# EAGLE design PRE_1_0 (EAGLE 8.3.2)
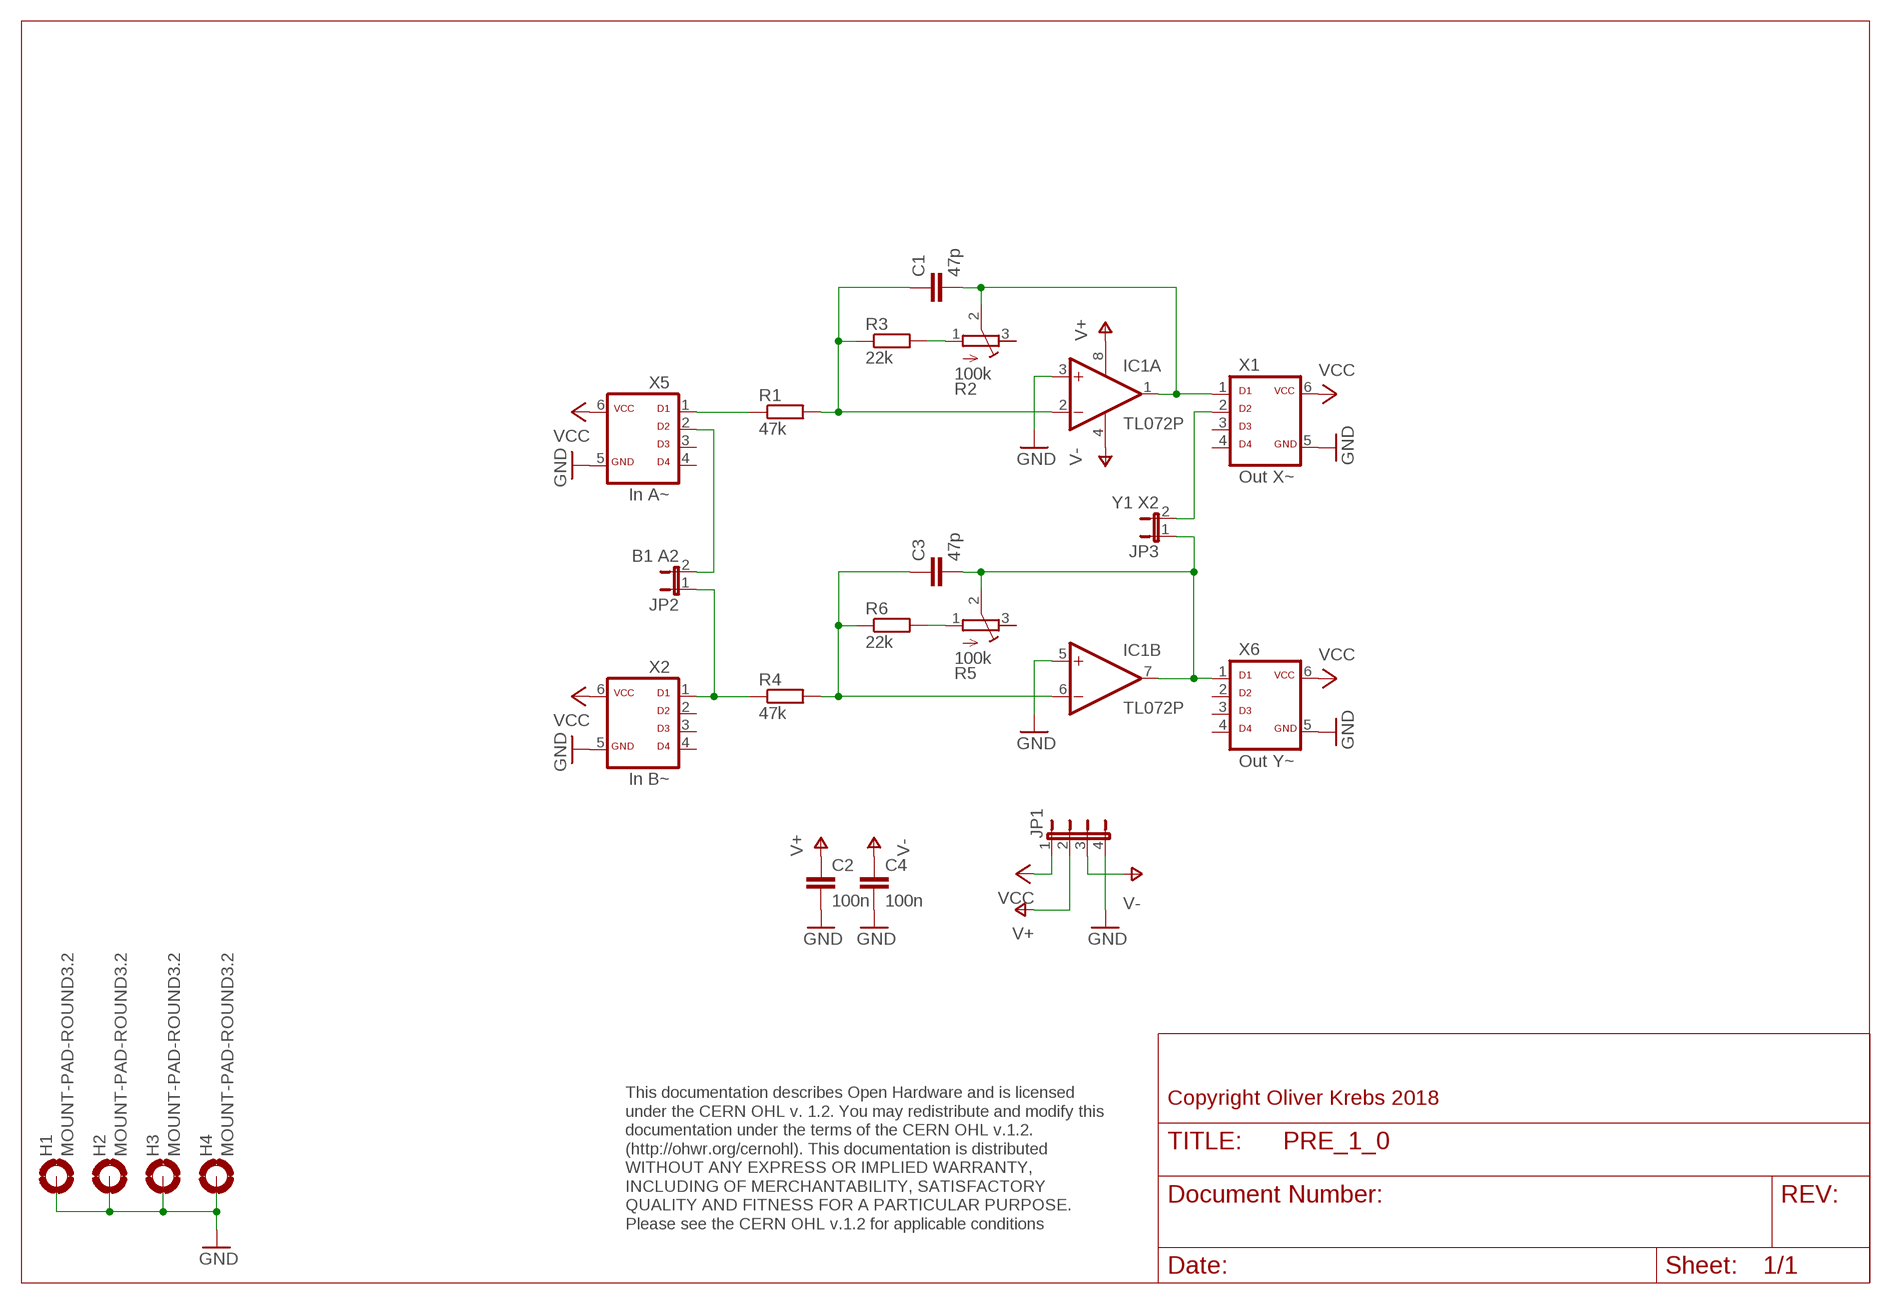
[diagram p0: schematic, sheet 1]

## Parts
C1  47p  C-EU050-025X075  [C050-025X075]
C2  100n  C-EU050-025X075  [C050-025X075]
C3  47p  C-EU050-025X075  [C050-025X075]
C4  100n  C-EU050-025X075  [C050-025X075]
H1  MOUNT-PAD-ROUND3.2  [3,2-PAD]
H2  MOUNT-PAD-ROUND3.2  [3,2-PAD]
H3  MOUNT-PAD-ROUND3.2  [3,2-PAD]
H4  MOUNT-PAD-ROUND3.2  [3,2-PAD]
IC1  TL072P  [DIL08]
JP1  JP4E  [JP4]
JP2  B1 A2  JP1E  [JP1]
JP3  Y1 X2  JP1E  [JP1]
R1  47k  R-EU_0207/10  [0207/10]
R2  100k  R-TRIMMACP  [ACP-6L]
R3  22k  R-EU_0207/10  [0207/10]
R4  47k  R-EU_0207/10  [0207/10]
R5  100k  R-TRIMMACP  [ACP-6L]
R6  22k  R-EU_0207/10  [0207/10]
X1  Out X~  ML6D  [ML-6]
X2  In B~  ML6D  [ML-6]
X5  In A~  ML6D  [ML-6]
X6  Out Y~  ML6D  [ML-6]

## Nets
GND: C2.2 C4.2 H1.B3,2(MOUNT) H2.B3,2(MOUNT) H3.B3,2(MOUNT) H4.B3,2(MOUNT) IC1.3(A:+IN) IC1.5(B:+IN) JP1.4 X1.5 X2.5 X5.5 X6.5
N$1: JP3.2 X1.2
N$2: R5.1(A) R6.2
N$3: C1.2 IC1.1(A:OUT) R2.2(S) X1.1
N$4: C3.2 IC1.7(B:OUT) JP3.1 R5.2(S) X6.1
N$5: C1.1 IC1.2(A:-IN) R1.2 R3.1
N$6: JP2.2 X5.2
N$7: R2.1(A) R3.2
N$8: C3.1 IC1.6(B:-IN) R4.2 R6.1
N$9: JP2.1 R4.1 X2.1
N$10: R1.1 X5.1
V+: C2.1 IC1.8(P:V+) JP1.2
V-: C4.1 IC1.4(P:V-) JP1.3
VCC: JP1.1 X1.6 X2.6 X5.6 X6.6
Unconnected: R2.3(E) R5.3(E) X1.3 X1.4 X2.2 X2.3 X2.4 X5.3 X5.4 X6.2 X6.3 X6.4

## Notes on the sheet
- Copyright Oliver Krebs 2018
- This documentation describes Open Hardware and is licensed 
  under the CERN OHL v. 1.2. You may redistribute and modify this 
  documentation under the terms of the CERN OHL v.1.2. 
  (http://ohwr.org/cernohl). This documentation is distributed
  WITHOUT ANY EXPRESS OR IMPLIED WARRANTY, 
  INCLUDING OF MERCHANTABILITY, SATISFACTORY 
  QUALITY AND FITNESS FOR A PARTICULAR PURPOSE. 
  Please see the CERN OHL v.1.2 for applicable conditions

## Library data of the parts
C1-C4 = 01-my_rcl:C-EU: CAPACITOR, European symbol
H1-H4 = holes:MOUNT-PAD-ROUND: MOUNTING PAD, round
IC1 = 01-my-linear:TL072: OP AMP
JP1 = 01-my-jumper:JP4E: JUMPER
JP2 JP3 = 01-my-jumper:JP1E: JUMPER
R1 R3 R4 R6 = 01-my_rcl:R-EU_: RESISTOR, European symbol
R2 R5 = 01-my_rcl:R-TRIMM: Trimm resistor
X1 X2 X5 X6 = 01-my-con:ML6D

## Board
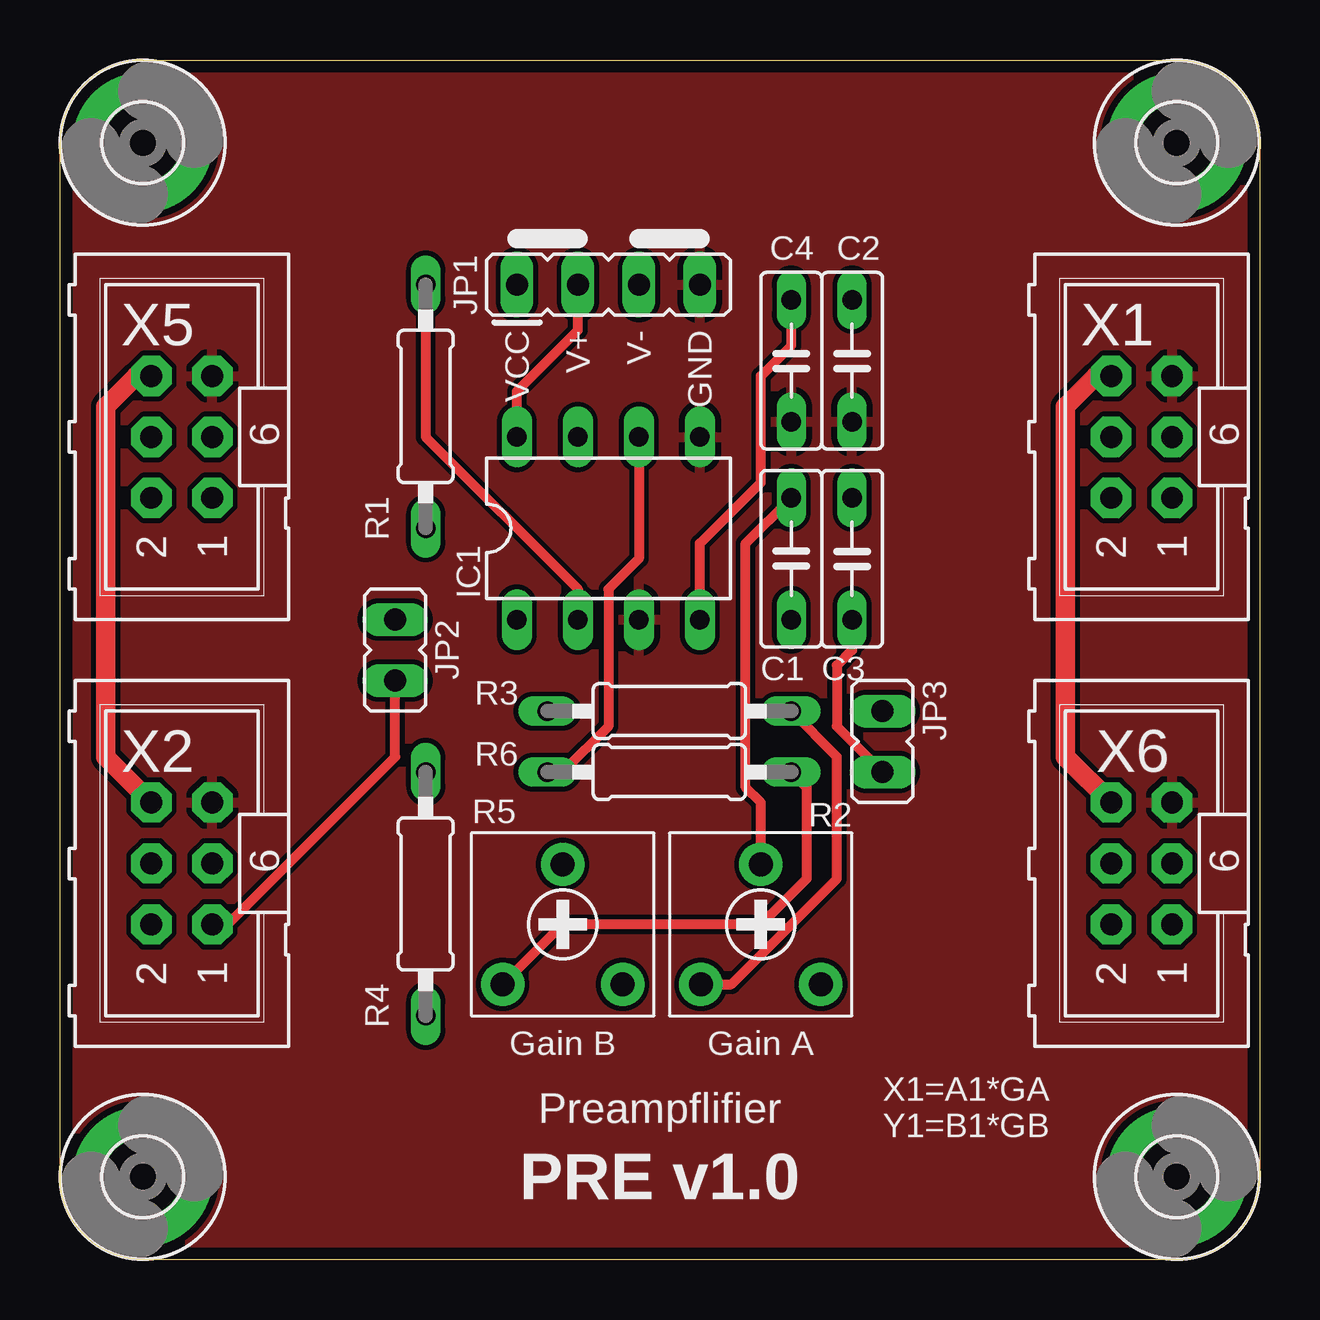
[diagram p1: board, top side]
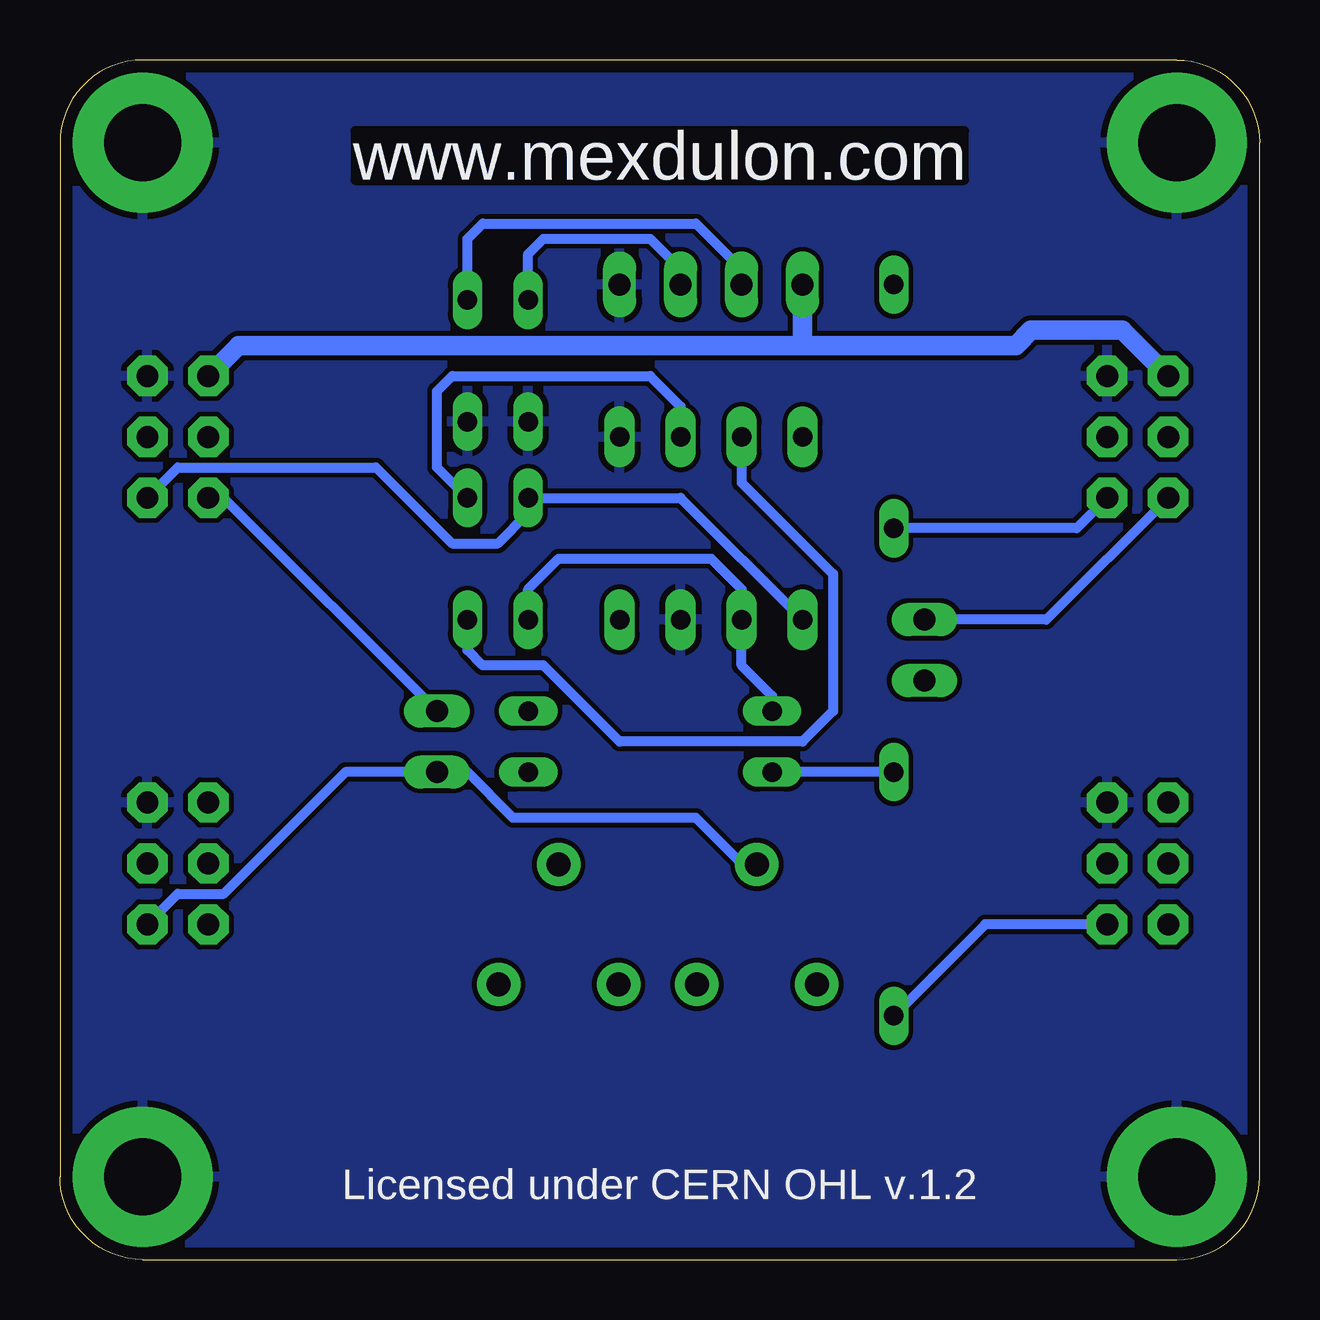
[diagram p2: board, bottom side, seen from below]

Size 50 x 50 mm. Coordinates in mm from the lower left corner, seen from the top.
Outline: 0,3.45 0,46.55 arc-90 3.45,50 46.55,50 arc-90 50,46.55 50,3.45 arc-90 46.55,0 3.45,0 arc-90 0,3.45
Copper layers (1*16): Top 0.035mm / dielectric 1.6mm / Bottom 0.035mm
Design rules "Elecrow_2-layer_PCB_eagle_rule_8mil": minimum track width 8mil, minimum drill 12mil, track to track 8mil, track to pad 8mil, pad to pad 8mil, via to via 8mil, smd to smd 0mil, copper to edge 20mil, drill to drill 10mil, minimum pad ring 6mil, minimum via ring 6mil, stop-mask expansion 0mil, vias tented up to drill 100mil, thermal gap 10mil

### Footprints (pad centres in the part's own frame; a part is rotated, then mirrored left to right if it is on the bottom)
C050-025X075 = drill 0.813 long: 1 -2.54,0; 2 2.54,0
3,2-PAD = drill 3.2 pad 5.842: B3,2 0,0
DIL08 = drill 0.813 pad 1.27 long: 1 -3.81,-3.81; 2 -1.27,-3.81; 3 1.27,-3.81; 4 3.81,-3.81; 5 3.81,3.81; 6 1.27,3.81; 7 -1.27,3.81; 8 -3.81,3.81
JP4 = drill 0.914 long: 1 -3.81,0; 2 -1.27,0; 3 1.27,0; 4 3.81,0
JP1 = drill 0.914 long: 1 0,-1.27; 2 0,1.27
0207/10 = drill 0.813 long: 1 -5.08,0; 2 5.08,0
ACP-6L = drill 1 pad 1.8: 1 -2.5,-2.5; 2 0,2.5; 3 2.5,-2.5
ML-6 = drill 0.914 pad 1.676 octagon: 1 -2.54,-1.27; 2 -2.54,1.27; 3 0,-1.27; 4 0,1.27; 5 2.54,-1.27; 6 2.54,1.27

### Placement (x,y rotation side)
C1  30.48,29.21 90 top
C2  33.02,37.47 270 top
C3  33.02,29.21 270 top
C4  30.48,37.47 270 top
H1  3.45,3.45 0 top
H2  3.45,46.55 0 top
H3  46.55,46.55 0 top
H4  46.55,3.45 0 top
IC1  22.86,30.48 0 top
JP1  22.86,40.64 0 top
JP2  13.97,25.4 0 top
JP3  34.29,21.59 0 top
R1  15.24,35.56 90 top
R2  29.21,13.97 0 top
R3  25.4,22.86 0 top
R4  15.24,15.24 90 top
R5  20.95,13.97 0 top
R6  25.4,20.32 0 top
X1  45.09,34.29 90 top
X2  5.08,16.51 90 top
X5  5.08,34.29 90 top
X6  45.09,16.51 90 top

### Tracks (layer width: path | path; a pad name or v marks a point on that pad's centre or on a via)
GND
  pour Bottom (isolate 0.203): 0,50.16 50.8,50.16 50.8,0 0,0
  pour Top (isolate 0.203): 0,50.16 50.8,50.16 50.8,0 0,0
N$1
  Bottom 0.406: X1.2 43.18,31.75 JP3.2
N$2
  Top 0.406: R6.2 31.11,19.68 31.11,15.88 29.21,13.97 20.95,13.97 R5.1
N$3
  Top 0.406: R2.2 29.21,19.05 28.57,19.68 28.57,29.84 C1.2
  Bottom 0.406: IC1.1 24.13,31.75 C1.2 30.48,31.11 31.75,29.84 33.66,29.84 36.83,33.02 45.09,33.02 X1.1
N$4
  Top 0.406: C3.2 33.02,25.4 32.38,24.77 32.38,22.23 JP3.1
  Bottom 0.406: X6.1 45.09,15.24 43.18,15.24 38.1,20.32 JP3.1 33.02,20.32 31.11,18.41 23.5,18.41 21.55,16.47 R5.2 | IC1.7 21.59,32.38 17.78,28.57 17.78,22.86 19.05,21.59 26.67,21.59 29.84,24.77 32.38,24.77 33.02,25.4 C3.2
N$5
  Top 0.406: R1.2 15.24,34.29 21.59,27.94 IC1.2
  Bottom 0.406: C1.1 30.48,27.94 29.21,29.21 22.86,29.21 21.59,27.94 IC1.2 21.59,24.77 20.32,23.5 R3.1
N$6
  Bottom 0.406: X5.2 8.89,26.67 JP2.2
N$7
  Top 0.406: R2.1 27.98,11.47 32.38,15.88 32.38,20.95 R3.2
N$8
  Top 0.406: IC1.6 24.13,29.21 22.86,27.94 22.86,22.23 20.95,20.32 R6.1
  Bottom 0.406: R4.2 R6.1 | C3.1 34.29,33.02 34.29,36.2 33.66,36.83 25.4,36.83 24.13,35.56 IC1.6
N$9
  Top 0.406: X2.1 6.99,13.97 13.97,20.95 JP2.1
  Bottom 0.406: X2.1 11.43,13.97 R4.1
N$10
  Bottom 0.406: X5.1 7.62,30.48 R1.1
V+
  Top 0.406: IC1.8 19.05,36.2 21.59,38.73 JP1.2
  Bottom 0.406: C2.1 33.02,42.55 32.38,43.18 23.5,43.18 21.59,41.27 JP1.2
V-
  Top 0.406: IC1.4 26.67,29.84 29.21,32.38 29.21,36.83 30.48,38.1 C4.1
  Bottom 0.406: C4.1 30.48,41.91 29.84,42.55 25.4,42.55 24.13,41.27 JP1.3
VCC
  Top 0.813: X5.6 3.17,36.83 1.91,35.56 1.91,20.95 X2.6 | X1.6 43.18,36.83 41.91,35.56 41.91,20.95 X6.6
  Bottom 0.813: X1.6 42.55,38.1 19.05,38.1 | 19.05,38.1 10.16,38.1 9.53,38.73 5.71,38.73 X5.6 | JP1.1 19.05,38.1

### Text on the board
Bottom: www.mexdulon.com
tNames: VCC | V+ | V- | GND | Gain B | Gain A | Preampflifier | X1=A1*GA / Y1=B1*GB | PRE v1.0
bNames: www.mexdulon.com | Licensed under CERN OHL v.1.2
200bmp: E:/Bilder/Elektronik/Modulion/Mexdulon/mexdulon_50x50_pcb.bmp